# Altium schematic sheet PAYL0007 Beaglebone Footprint.SchDoc
size A4; DocumentNumber: 1; SheetNumber: 2; SheetTotal: 6
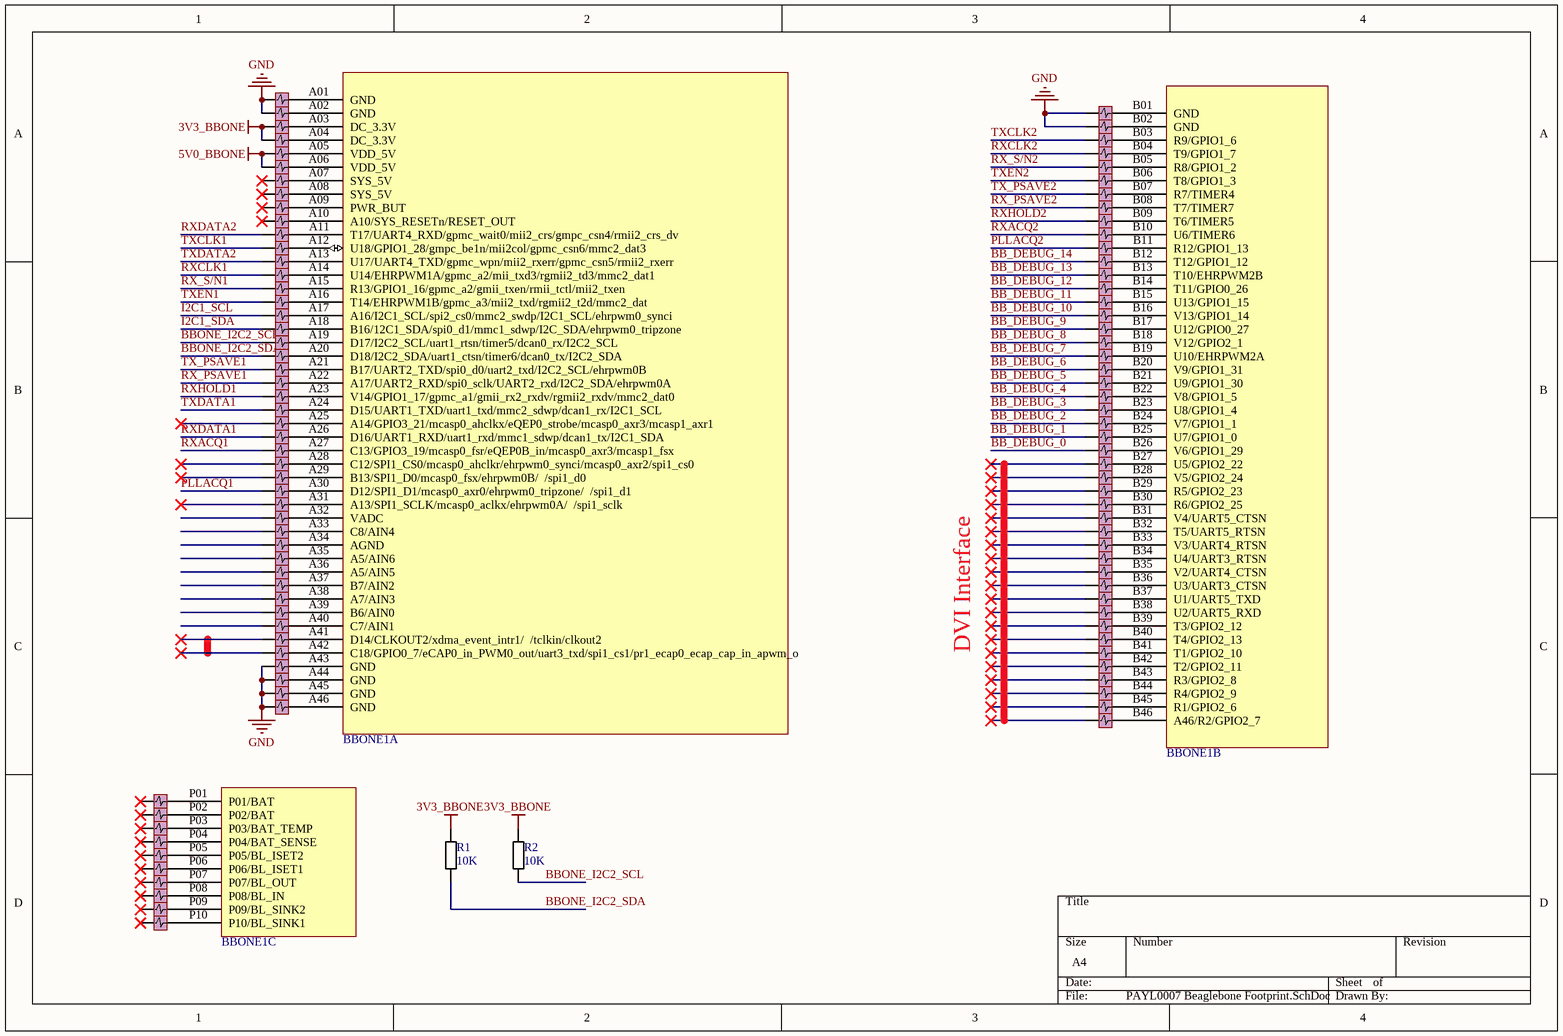
[diagram p0: PAYL0007 Beaglebone Footprint.SchDoc]

## Parts
BBONE1  Beagle_Bone  [Beaglebone]  (value not drawn)  (parts A,B,C of 3)
P1  Jumper_Filter  [Jumper_filter]  (value not drawn)
P2  Jumper_Filter  [Jumper_filter]  (value not drawn)
P3  Jumper_Filter  [Jumper_filter]  (value not drawn)
P4  Jumper_Filter  [Jumper_filter]  (value not drawn)
P5  Jumper_Filter  [Jumper_filter]  (value not drawn)
P6  Jumper_Filter  [Jumper_filter]  (value not drawn)
P7  Jumper_Filter  [Jumper_filter]  (value not drawn)
P8  Jumper_Filter  [Jumper_filter]  (value not drawn)
P9  Jumper_Filter  [Jumper_filter]  (value not drawn)
P10  Jumper_Filter  [Jumper_filter]  (value not drawn)
P11  Jumper_Filter  [Jumper_filter]  (value not drawn)
P12  Jumper_Filter  [Jumper_filter]  (value not drawn)
P13  Jumper_Filter  [Jumper_filter]  (value not drawn)
P14  Jumper_Filter  [Jumper_filter]  (value not drawn)
P15  Jumper_Filter  [Jumper_filter]  (value not drawn)
P16  Jumper_Filter  [Jumper_filter]  (value not drawn)
P17  Jumper_Filter  [Jumper_filter]  (value not drawn)
P18  Jumper_Filter  [Jumper_filter]  (value not drawn)
P19  Jumper_Filter  [Jumper_filter]  (value not drawn)
P20  Jumper_Filter  [Jumper_filter]  (value not drawn)
P21  Jumper_Filter  [Jumper_filter]  (value not drawn)
P22  Jumper_Filter  [Jumper_filter]  (value not drawn)
P23  Jumper_Filter  [Jumper_filter]  (value not drawn)
P24  Jumper_Filter  [Jumper_filter]  (value not drawn)
P25  Jumper_Filter  [Jumper_filter]  (value not drawn)
P26  Jumper_Filter  [Jumper_filter]  (value not drawn)
P27  Jumper_Filter  [Jumper_filter]  (value not drawn)
P28  Jumper_Filter  [Jumper_filter]  (value not drawn)
P29  Jumper_Filter  [Jumper_filter]  (value not drawn)
P30  Jumper_Filter  [Jumper_filter]  (value not drawn)
P31  Jumper_Filter  [Jumper_filter]  (value not drawn)
P32  Jumper_Filter  [Jumper_filter]  (value not drawn)
P33  Jumper_Filter  [Jumper_filter]  (value not drawn)
P34  Jumper_Filter  [Jumper_filter]  (value not drawn)
P35  Jumper_Filter  [Jumper_filter]  (value not drawn)
P36  Jumper_Filter  [Jumper_filter]  (value not drawn)
P37  Jumper_Filter  [Jumper_filter]  (value not drawn)
P38  Jumper_Filter  [Jumper_filter]  (value not drawn)
P39  Jumper_Filter  [Jumper_filter]  (value not drawn)
P40  Jumper_Filter  [Jumper_filter]  (value not drawn)
P41  Jumper_Filter  [Jumper_filter]  (value not drawn)
P42  Jumper_Filter  [Jumper_filter]  (value not drawn)
P43  Jumper_Filter  [Jumper_filter]  (value not drawn)
P44  Jumper_Filter  [Jumper_filter]  (value not drawn)
P45  Jumper_Filter  [Jumper_filter]  (value not drawn)
P46  Jumper_Filter  [Jumper_filter]  (value not drawn)
P47  Jumper_Filter  [Jumper_filter]  (value not drawn)
P48  Jumper_Filter  [Jumper_filter]  (value not drawn)
P49  Jumper_Filter  [Jumper_filter]  (value not drawn)
P50  Jumper_Filter  [Jumper_filter]  (value not drawn)
P51  Jumper_Filter  [Jumper_filter]  (value not drawn)
P52  Jumper_Filter  [Jumper_filter]  (value not drawn)
P53  Jumper_Filter  [Jumper_filter]  (value not drawn)
P54  Jumper_Filter  [Jumper_filter]  (value not drawn)
P55  Jumper_Filter  [Jumper_filter]  (value not drawn)
P56  Jumper_Filter  [Jumper_filter]  (value not drawn)
P57  Jumper_Filter  [Jumper_filter]  (value not drawn)
P58  Jumper_Filter  [Jumper_filter]  (value not drawn)
P59  Jumper_Filter  [Jumper_filter]  (value not drawn)
P60  Jumper_Filter  [Jumper_filter]  (value not drawn)
P61  Jumper_Filter  [Jumper_filter]  (value not drawn)
P62  Jumper_Filter  [Jumper_filter]  (value not drawn)
P63  Jumper_Filter  [Jumper_filter]  (value not drawn)
P64  Jumper_Filter  [Jumper_filter]  (value not drawn)
P65  Jumper_Filter  [Jumper_filter]  (value not drawn)
P66  Jumper_Filter  [Jumper_filter]  (value not drawn)
P67  Jumper_Filter  [Jumper_filter]  (value not drawn)
P68  Jumper_Filter  [Jumper_filter]  (value not drawn)
P69  Jumper_Filter  [Jumper_filter]  (value not drawn)
P70  Jumper_Filter  [Jumper_filter]  (value not drawn)
P71  Jumper_Filter  [Jumper_filter]  (value not drawn)
P72  Jumper_Filter  [Jumper_filter]  (value not drawn)
P73  Jumper_Filter  [Jumper_filter]  (value not drawn)
P74  Jumper_Filter  [Jumper_filter]  (value not drawn)
P75  Jumper_Filter  [Jumper_filter]  (value not drawn)
P76  Jumper_Filter  [Jumper_filter]  (value not drawn)
P77  Jumper_Filter  [Jumper_filter]  (value not drawn)
P78  Jumper_Filter  [Jumper_filter]  (value not drawn)
P79  Jumper_Filter  [Jumper_filter]  (value not drawn)
P80  Jumper_Filter  [Jumper_filter]  (value not drawn)
P81  Jumper_Filter  [Jumper_filter]  (value not drawn)
P82  Jumper_Filter  [Jumper_filter]  (value not drawn)
P83  Jumper_Filter  [Jumper_filter]  (value not drawn)
P84  Jumper_Filter  [Jumper_filter]  (value not drawn)
P85  Jumper_Filter  [Jumper_filter]  (value not drawn)
P86  Jumper_Filter  [Jumper_filter]  (value not drawn)
P87  Jumper_Filter  [Jumper_filter]  (value not drawn)
P88  Jumper_Filter  [Jumper_filter]  (value not drawn)
P89  Jumper_Filter  [Jumper_filter]  (value not drawn)
P90  Jumper_Filter  [Jumper_filter]  (value not drawn)
P91  Jumper_Filter  [Jumper_filter]  (value not drawn)
P92  Jumper_Filter  [Jumper_filter]  (value not drawn)
P93  Jumper_Filter  [Jumper_filter]  (value not drawn)
P94  Jumper_Filter  [Jumper_filter]  (value not drawn)
P95  Jumper_Filter  [Jumper_filter]  (value not drawn)
P96  Jumper_Filter  [Jumper_filter]  (value not drawn)
P97  Jumper_Filter  [Jumper_filter]  (value not drawn)
P98  Jumper_Filter  [Jumper_filter]  (value not drawn)
P99  Jumper_Filter  [Jumper_filter]  (value not drawn)
P100  Jumper_Filter  [Jumper_filter]  (value not drawn)
P101  Jumper_Filter  [Jumper_filter]  (value not drawn)
P102  Jumper_Filter  [Jumper_filter]  (value not drawn)
R1  value 10K  [6-0805_M]  (hidden comment: 1206 Resistor)
R2  value 10K  [6-0805_M]  (hidden comment: 1206 Resistor)

## Nets
3V3_BBONE: P3.1 P4.1 R1.1 R2.1
5V0_BBONE: P5.1 P6.1
GND: P1.1 P1.3 P2.1 P2.3 P3.3 P4.3 P5.3 P6.3 P7.3 P8.3 P9.3 P10.3 P11.3 P12.3 P13.3 P14.3 P15.3 P16.3 P17.3 P18.3 P19.3 P20.3 P21.3 P22.3 P23.3 P24.3 P25.3 P26.3 P27.3 P28.3 P29.3 P30.3 P31.3 P32.3 P33.3 P34.3 P35.3 P36.3 P37.3 P38.3 P39.3 P40.3 P41.3 P42.3 P43.1 P43.3 P44.1 P44.3 P45.1 P45.3 P46.1 P46.3 P47.1 P47.3 P48.1 P48.3 P49.3 P50.3 P51.3 P52.3 P53.3 P54.3 P55.3 P56.3 P57.3 P58.3 P59.3 P60.3 P61.3 P62.3 P63.3 P64.3 P65.3 P66.3 P67.3 P68.3 P69.3 P70.3 P71.3 P72.3 P73.3 P74.3 P75.3 P76.3 P77.3 P78.3 P79.3 P80.3 P81.3 P82.3 P83.3 P84.3 P85.3 P86.3 P87.3 P88.3 P89.3 P90.3 P91.3 P92.3 P93.3 P94.3 P95.3 P96.3 P97.3 P98.3 P99.3 P100.3 P101.3 P102.3
BB_DEBUG_0: P72.1
BB_DEBUG_1: P71.1
BB_DEBUG_2: P70.1
BB_DEBUG_3: P69.1
BB_DEBUG_4: P68.1
BB_DEBUG_5: P67.1
BB_DEBUG_6: P66.1
BB_DEBUG_7: P65.1
BB_DEBUG_8: P64.1
BB_DEBUG_9: P63.1
BB_DEBUG_10: P62.1
BB_DEBUG_11: P61.1
BB_DEBUG_12: P60.1
BB_DEBUG_13: P59.1
BB_DEBUG_14: P58.1
BBONE_I2C2_SCL: P19.1 R2.2
BBONE_I2C2_SDA: P20.1 R1.2
I2C1_SCL: P17.1
I2C1_SDA: P18.1
PLLACQ1: P30.1
PLLACQ2: P57.1
RX_PSAVE1: P22.1
RX_PSAVE2: P54.1
RX_S/N1: P15.1
RX_S/N2: P51.1
RXACQ1: P27.1
RXACQ2: P56.1
RXCLK1: P14.1
RXCLK2: P50.1
RXDATA1: P26.1
RXDATA2: P11.1
RXHOLD1: P23.1
RXHOLD2: P55.1
TX_PSAVE1: P21.1
TX_PSAVE2: P53.1
TXCLK1: P12.1
TXCLK2: P49.1
TXDATA1: P24.1
TXDATA2: P13.1
TXEN1: P16.1
TXEN2: P52.1
NetBBONE1_A01: BBONE1.A01(GND) P1.2
NetBBONE1_A02: BBONE1.A02(GND) P2.2
NetBBONE1_A03: BBONE1.A03(DC_3.3V) P3.2
NetBBONE1_A04: BBONE1.A04(DC_3.3V) P4.2
NetBBONE1_A05: BBONE1.A05(VDD_5V) P5.2
NetBBONE1_A06: BBONE1.A06(VDD_5V) P6.2
NetBBONE1_A07: BBONE1.A07(SYS_5V) P7.2
NetBBONE1_A08: BBONE1.A08(SYS_5V) P8.2
NetBBONE1_A09: BBONE1.A09(PWR_BUT) P9.2
NetBBONE1_A10: BBONE1.A10(A10/SYS_RESETn/RESET_OUT) P10.2
NetBBONE1_A11: BBONE1.A11(T17/UART4_RXD/gpmc_wait0/mii2_crs/gmpc_csn4/rmii2_crs_dv) P11.2
NetBBONE1_A12: BBONE1.A12(U18/GPIO1_28/gmpc_be1n/mii2col/gpmc_csn6/mmc2_dat3) P12.2
NetBBONE1_A13: BBONE1.A13(U17/UART4_TXD/gpmc_wpn/mii2_rxerr/gpmc_csn5/rmii2_rxerr) P13.2
NetBBONE1_A14: BBONE1.A14(U14/EHRPWM1A/gpmc_a2/mii_txd3/rgmii2_td3/mmc2_dat1) P14.2
NetBBONE1_A15: BBONE1.A15(R13/GPIO1_16/gpmc_a2/gmii_txen/rmii_tctl/mii2_txen) P15.2
NetBBONE1_A16: BBONE1.A16(T14/EHRPWM1B/gpmc_a3/mii2_txd/rgmii2_t2d/mmc2_dat) P16.2
NetBBONE1_A17: BBONE1.A17(A16/I2C1_SCL/spi2_cs0/mmc2_swdp/I2C1_SCL/ehrpwm0_synci) P17.2
NetBBONE1_A18: BBONE1.A18(B16/12C1_SDA/spi0_d1/mmc1_sdwp/I2C_SDA/ehrpwm0_tripzone) P18.2
NetBBONE1_A19: BBONE1.A19(D17/I2C2_SCL/uart1_rtsn/timer5/dcan0_rx/I2C2_SCL) P19.2
NetBBONE1_A20: BBONE1.A20(D18/I2C2_SDA/uart1_ctsn/timer6/dcan0_tx/I2C2_SDA) P20.2
NetBBONE1_A21: BBONE1.A21(B17/UART2_TXD/spi0_d0/uart2_txd/I2C2_SCL/ehrpwm0B) P21.2
NetBBONE1_A22: BBONE1.A22(A17/UART2_RXD/spi0_sclk/UART2_rxd/I2C2_SDA/ehrpwm0A) P22.2
NetBBONE1_A23: BBONE1.A23(V14/GPIO1_17/gpmc_a1/gmii_rx2_rxdv/rgmii2_rxdv/mmc2_dat0) P23.2
NetBBONE1_A24: BBONE1.A24(D15/UART1_TXD/uart1_txd/mmc2_sdwp/dcan1_rx/I2C1_SCL) P24.2
NetBBONE1_A25: BBONE1.A25(A14/GPIO3_21/mcasp0_ahclkx/eQEP0_strobe/mcasp0_axr3/mcasp1_axr1) P25.2
NetBBONE1_A26: BBONE1.A26(D16/UART1_RXD/uart1_rxd/mmc1_sdwp/dcan1_tx/I2C1_SDA) P26.2
NetBBONE1_A27: BBONE1.A27(C13/GPIO3_19/mcasp0_fsr/eQEP0B_in/mcasp0_axr3/mcasp1_fsx) P27.2
NetBBONE1_A28: BBONE1.A28(C12/SPI1_CS0/mcasp0_ahclkr/ehrpwm0_synci/mcasp0_axr2/spi1_cs0) P28.2
NetBBONE1_A29: BBONE1.A29(B13/SPI1_D0/mcasp0_fsx/ehrpwm0B/__/spi1_d0) P29.2
NetBBONE1_A30: BBONE1.A30(D12/SPI1_D1/mcasp0_axr0/ehrpwm0_tripzone/__/spi1_d1) P30.2
NetBBONE1_A31: BBONE1.A31(A13/SPI1_SCLK/mcasp0_aclkx/ehrpwm0A/__/spi1_sclk) P31.2
NetBBONE1_A32: BBONE1.A32(VADC) P32.2
NetBBONE1_A33: BBONE1.A33(C8/AIN4) P33.2
NetBBONE1_A34: BBONE1.A34(AGND) P34.2
NetBBONE1_A35: BBONE1.A35(A5/AIN6) P35.2
NetBBONE1_A36: BBONE1.A36(A5/AIN5) P36.2
NetBBONE1_A37: BBONE1.A37(B7/AIN2) P37.2
NetBBONE1_A38: BBONE1.A38(A7/AIN3) P38.2
NetBBONE1_A39: BBONE1.A39(B6/AIN0) P39.2
NetBBONE1_A40: BBONE1.A40(C7/AIN1) P40.2
NetBBONE1_A41: BBONE1.A41(D14/CLKOUT2/xdma_event_intr1/__/tclkin/clkout2) P41.2
NetBBONE1_A42: BBONE1.A42(C18/GPIO0_7/eCAP0_in_PWM0_out/uart3_txd/spi1_cs1/pr1_ecap0_ecap_cap_in_apwm_o) P42.2
NetBBONE1_A43: BBONE1.A43(GND) P43.2
NetBBONE1_A44: BBONE1.A44(GND) P44.2
NetBBONE1_A45: BBONE1.A45(GND) P45.2
NetBBONE1_A46: BBONE1.A46(GND) P46.2
NetBBONE1_B01: BBONE1.B01(GND) P47.2
NetBBONE1_B02: BBONE1.B02(GND) P48.2
NetBBONE1_B03: BBONE1.B03(R9/GPIO1_6) P49.2
NetBBONE1_B04: BBONE1.B04(T9/GPIO1_7) P50.2
NetBBONE1_B05: BBONE1.B05(R8/GPIO1_2) P51.2
NetBBONE1_B06: BBONE1.B06(T8/GPIO1_3) P52.2
NetBBONE1_B07: BBONE1.B07(R7/TIMER4) P53.2
NetBBONE1_B08: BBONE1.B08(T7/TIMER7) P54.2
NetBBONE1_B09: BBONE1.B09(T6/TIMER5) P55.2
NetBBONE1_B10: BBONE1.B10(U6/TIMER6) P56.2
NetBBONE1_B11: BBONE1.B11(R12/GPIO1_13) P57.2
NetBBONE1_B12: BBONE1.B12(T12/GPIO1_12) P58.2
NetBBONE1_B13: BBONE1.B13(T10/EHRPWM2B) P59.2
NetBBONE1_B14: BBONE1.B14(T11/GPIO0_26) P60.2
NetBBONE1_B15: BBONE1.B15(U13/GPIO1_15) P61.2
NetBBONE1_B16: BBONE1.B16(V13/GPIO1_14) P62.2
NetBBONE1_B17: BBONE1.B17(U12/GPIO0_27) P63.2
NetBBONE1_B18: BBONE1.B18(V12/GPIO2_1) P64.2
NetBBONE1_B19: BBONE1.B19(U10/EHRPWM2A) P65.2
NetBBONE1_B20: BBONE1.B20(V9/GPIO1_31) P66.2
NetBBONE1_B21: BBONE1.B21(U9/GPIO1_30) P67.2
NetBBONE1_B22: BBONE1.B22(V8/GPIO1_5) P68.2
NetBBONE1_B23: BBONE1.B23(U8/GPIO1_4) P69.2
NetBBONE1_B24: BBONE1.B24(V7/GPIO1_1) P70.2
NetBBONE1_B25: BBONE1.B25(U7/GPIO1_0) P71.2
NetBBONE1_B26: BBONE1.B26(V6/GPIO1_29) P72.2
NetBBONE1_B27: BBONE1.B27(U5/GPIO2_22) P73.2
NetBBONE1_B28: BBONE1.B28(V5/GPIO2_24) P74.2
NetBBONE1_B29: BBONE1.B29(R5/GPIO2_23) P75.2
NetBBONE1_B30: BBONE1.B30(R6/GPIO2_25) P76.2
NetBBONE1_B31: BBONE1.B31(V4/UART5_CTSN) P77.2
NetBBONE1_B32: BBONE1.B32(T5/UART5_RTSN) P78.2
NetBBONE1_B33: BBONE1.B33(V3/UART4_RTSN) P79.2
NetBBONE1_B34: BBONE1.B34(U4/UART3_RTSN) P80.2
NetBBONE1_B35: BBONE1.B35(V2/UART4_CTSN) P81.2
NetBBONE1_B36: BBONE1.B36(U3/UART3_CTSN) P82.2
NetBBONE1_B37: BBONE1.B37(U1/UART5_TXD) P83.2
NetBBONE1_B38: BBONE1.B38(U2/UART5_RXD) P84.2
NetBBONE1_B39: BBONE1.B39(T3/GPIO2_12) P85.2
NetBBONE1_B40: BBONE1.B40(T4/GPIO2_13) P86.2
NetBBONE1_B41: BBONE1.B41(T1/GPIO2_10) P87.2
NetBBONE1_B42: BBONE1.B42(T2/GPIO2_11) P88.2
NetBBONE1_B43: BBONE1.B43(R3/GPIO2_8) P89.2
NetBBONE1_B44: BBONE1.B44(R4/GPIO2_9) P90.2
NetBBONE1_B45: BBONE1.B45(R1/GPIO2_6) P91.2
NetBBONE1_B46: BBONE1.B46(A46/R2/GPIO2_7) P92.2
NetBBONE1_P01: BBONE1.P01(P01/BAT) P93.2
NetBBONE1_P02: BBONE1.P02(P02/BAT) P94.2
NetBBONE1_P03: BBONE1.P03(P03/BAT_TEMP) P95.2
NetBBONE1_P04: BBONE1.P04(P04/BAT_SENSE) P96.2
NetBBONE1_P05: BBONE1.P05(P05/BL_ISET2) P97.2
NetBBONE1_P06: BBONE1.P06(P06/BL_ISET1) P98.2
NetBBONE1_P07: BBONE1.P07(P07/BL_OUT) P99.2
NetBBONE1_P08: BBONE1.P08(P08/BL_IN) P100.2
NetBBONE1_P09: BBONE1.P09(P09/BL_SINK2) P101.2
NetBBONE1_P10: BBONE1.P10(P10/BL_SINK1) P102.2

Not connected (* = marked no-connect by the designer): P7 1*; P8 1*; P9 1*; P10 1*; P25 1*; P28 1*; P29 1*; P31 1*; P32 1; P33 1; P34 1; P35 1; P36 1; P37 1; P38 1; P39 1; P40 1; P41 1*; P42 1*; P73 1*; P74 1*; P75 1*; P76 1*; P77 1*; P78 1*; P79 1*; P80 1*; P81 1*; P82 1*; P83 1*; P84 1*; P85 1*; P86 1*; P87 1*; P88 1*; P89 1*; P90 1*; P91 1*; P92 1*; P93 1*; P94 1*; P95 1*; P96 1*; P97 1*; P98 1*; P99 1*; P100 1*; P101 1*; P102 1*

## Notes on the sheet
- DVI Interface

## Library data of the parts
R1 R2 = 1206 Thick Film Resistor 1%